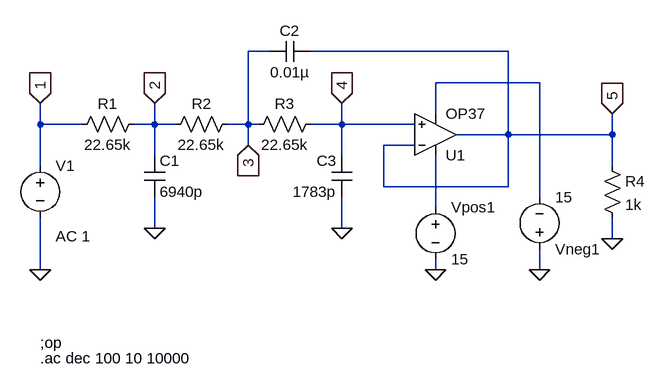
[diagram p0: schematic OpAmp circuit 1.asc]
OpAmp circuit 1.asc, the LTspice schematic file:
Version 4
SHEET 1 1432 836
WIRE 304 0 272 0
WIRE 672 0 368 0
WIRE 720 48 560 48
WIRE 560 96 560 48
WIRE -48 112 -48 80
WIRE 16 112 -48 112
WIRE 128 112 128 80
WIRE 128 112 96 112
WIRE 160 112 128 112
WIRE 272 112 272 0
WIRE 272 112 240 112
WIRE 288 112 272 112
WIRE 416 112 416 80
WIRE 416 112 368 112
WIRE 528 112 416 112
WIRE 672 128 672 0
WIRE 672 128 592 128
WIRE 832 128 832 96
WIRE 832 128 672 128
WIRE 272 144 272 112
WIRE 528 144 480 144
WIRE 128 160 128 112
WIRE 416 160 416 112
WIRE -48 176 -48 112
WIRE 832 176 832 128
WIRE 480 208 480 144
WIRE 672 208 672 128
WIRE 672 208 480 208
WIRE 720 224 720 48
WIRE 560 240 560 160
WIRE 128 272 128 224
WIRE 416 272 416 224
WIRE 832 288 832 256
WIRE -48 336 -48 256
WIRE 560 336 560 320
WIRE 720 336 720 304
FLAG -48 336 0
FLAG 128 272 0
FLAG 416 272 0
FLAG 832 288 0
FLAG 720 336 0
FLAG 560 336 0
FLAG -48 80 1
IOPIN -48 80 In
FLAG 128 80 2
IOPIN 128 80 In
FLAG 272 144 3
IOPIN 272 144 In
FLAG 416 80 4
IOPIN 416 80 In
FLAG 832 96 5
IOPIN 832 96 In
SYMBOL voltage -48 160 R0
WINDOW 123 24 124 Left 2
WINDOW 39 0 0 Left 2
SYMATTR Value2 AC 1
SYMATTR InstName V1
SYMATTR Value ""
SYMBOL res 0 128 R270
WINDOW 0 32 56 VTop 2
WINDOW 3 0 56 VBottom 2
SYMATTR InstName R1
SYMATTR Value 22.65k
SYMBOL res 144 128 R270
WINDOW 0 32 56 VTop 2
WINDOW 3 0 56 VBottom 2
SYMATTR InstName R2
SYMATTR Value 22.65k
SYMBOL res 272 128 R270
WINDOW 0 32 56 VTop 2
WINDOW 3 0 56 VBottom 2
SYMATTR InstName R3
SYMATTR Value 22.65k
SYMBOL res 816 160 R0
SYMATTR InstName R4
SYMATTR Value 1k
SYMBOL cap 112 160 R0
SYMATTR InstName C1
SYMATTR Value 6940p
SYMBOL cap 304 16 R270
WINDOW 0 32 32 VTop 2
WINDOW 3 0 32 VBottom 2
SYMATTR InstName C2
SYMATTR Value 0.01µ
SYMBOL cap 432 224 R180
WINDOW 0 24 56 Left 2
WINDOW 3 24 8 Left 2
SYMATTR InstName C3
SYMATTR Value 1783p
SYMBOL Opamps\\OP37 560 192 M180
SYMATTR InstName U1
SYMBOL voltage 720 320 M180
WINDOW 123 0 0 Left 2
WINDOW 39 0 0 Left 2
SYMATTR InstName Vneg1
SYMATTR Value 15
SYMBOL voltage 560 224 R0
WINDOW 123 0 0 Left 2
WINDOW 39 0 0 Left 2
SYMATTR InstName Vpos1
SYMATTR Value 15
TEXT -48 448 Left 2 !;op
TEXT -48 472 Left 2 !.ac dec 100 10 10000

The netlist it stands for:
* OpAmp circuit 1.asc
V1 1 0 AC 1
R1 1 2 22.65k
R2 2 3 22.65k
R3 3 4 22.65k
R4 5 0 1k
C1 2 0 6940p
C2 3 5 0.01µ
C3 0 4 1783p
XU1 4 5 N002 N001 5 LT1037  ; OP37, pins In+ In- V+ V- OUT
Vneg1 0 N001 15
Vpos1 N002 0 15
;op
.ac dec 100 10 10000
.lib LTC.lib
.backanno
.end